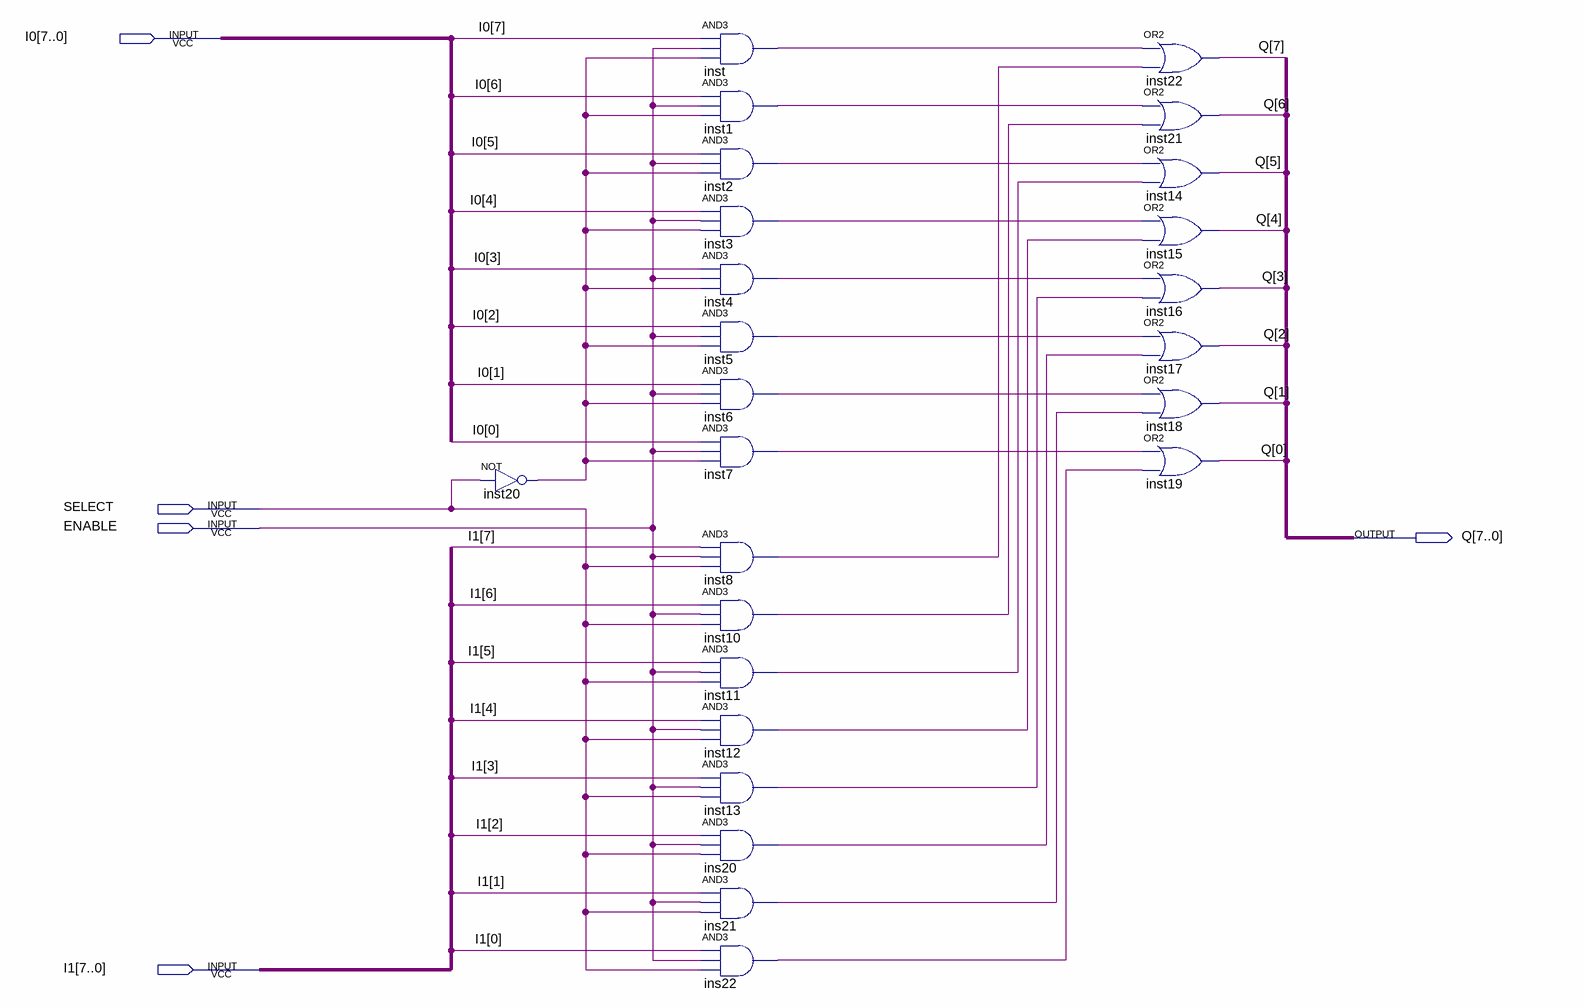
[diagram p0: schematic sheet]
// Quartus schematic Mux2_8b.bdf as structural Verilog: 25 symbols, 5 pins
module Mux2_8b (
  input  [7:0] I0,
  input  SELECT,
  input  ENABLE,
  input  [7:0] I1,
  output [7:0] Q
);

  wire ins20_out, ins21_out, ins22_out, inst1_out, inst2_out, inst3_out, inst4_out, inst5_out, inst6_out,
       inst7_out, inst8_out, inst10_out, inst11_out, inst12_out, inst13_out, inst20_out, inst_out;

  not inst20 (inst20_out, SELECT);
  and inst (inst_out, I0[7], ENABLE, inst20_out);
  and inst1 (inst1_out, I0[6], ENABLE, inst20_out);
  and inst2 (inst2_out, I0[5], ENABLE, inst20_out);
  and inst3 (inst3_out, I0[4], ENABLE, inst20_out);
  and inst4 (inst4_out, I0[3], ENABLE, inst20_out);
  and inst5 (inst5_out, I0[2], ENABLE, inst20_out);
  and inst6 (inst6_out, I0[1], ENABLE, inst20_out);
  and inst7 (inst7_out, I0[0], ENABLE, inst20_out);
  and inst8 (inst8_out, I1[7], ENABLE, SELECT);
  and inst10 (inst10_out, I1[6], ENABLE, SELECT);
  and inst11 (inst11_out, I1[5], ENABLE, SELECT);
  and inst12 (inst12_out, I1[4], ENABLE, SELECT);
  and inst13 (inst13_out, I1[3], ENABLE, SELECT);
  and ins20 (ins20_out, I1[2], ENABLE, SELECT);
  and ins21 (ins21_out, I1[1], ENABLE, SELECT);
  and ins22 (ins22_out, I1[0], ENABLE, SELECT);
  or inst22 (Q[7], inst_out, inst8_out);
  or inst21 (Q[6], inst1_out, inst10_out);
  or inst14 (Q[5], inst2_out, inst11_out);
  or inst15 (Q[4], inst3_out, inst12_out);
  or inst16 (Q[3], inst4_out, inst13_out);
  or inst17 (Q[2], inst5_out, ins20_out);
  or inst18 (Q[1], inst6_out, ins21_out);
  or inst19 (Q[0], inst7_out, ins22_out);
endmodule
